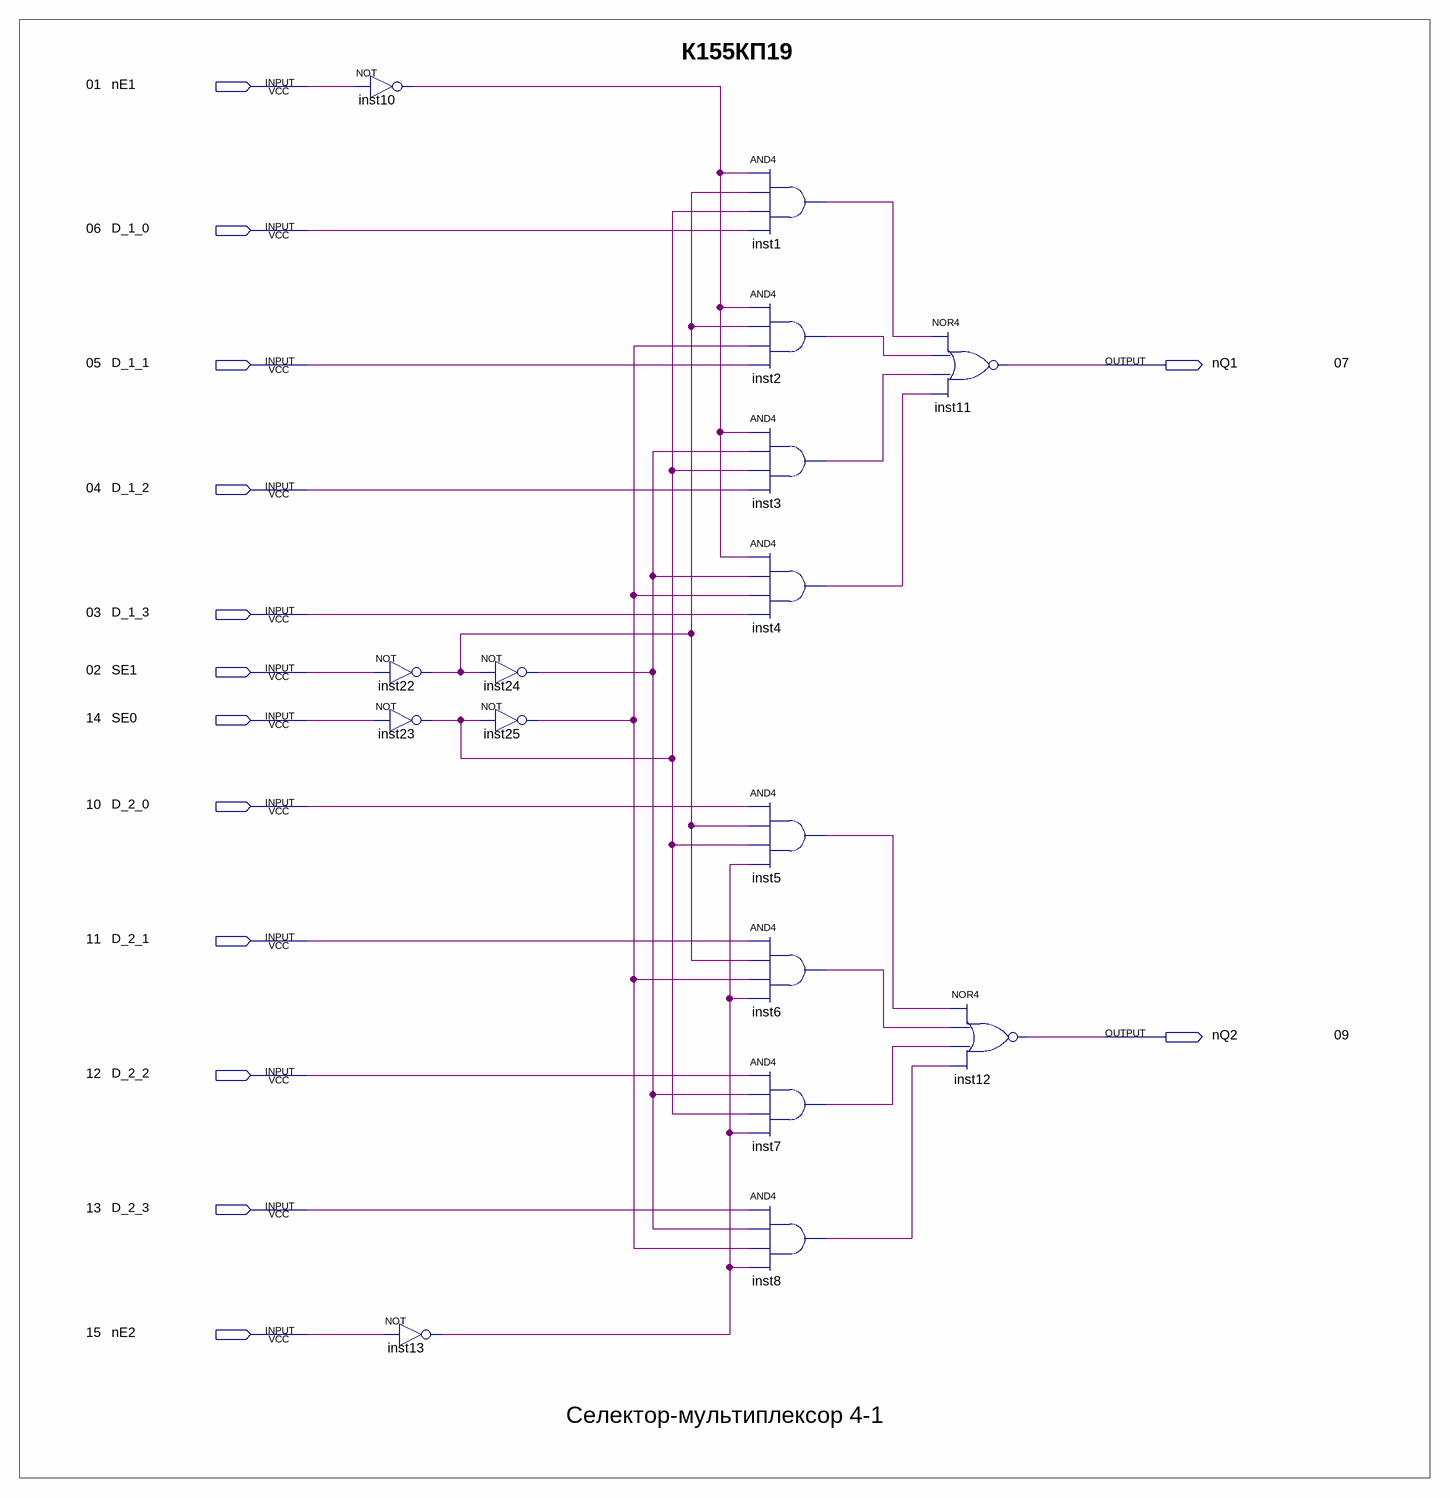
[diagram p0: schematic sheet]
// Quartus schematic K155KP19.bdf as structural Verilog: 16 symbols, 14 pins
module K155KP19 (
  input  nE1,
  input  D_1_0,
  input  D_1_1,
  input  D_1_2,
  input  D_1_3,
  input  SE1,
  input  SE0,
  input  D_2_0,
  input  D_2_1,
  input  D_2_2,
  input  D_2_3,
  input  nE2,
  output nQ1,
  output nQ2
);

  wire inst1_out, inst2_out, inst3_out, inst4_out, inst5_out, inst6_out, inst7_out, inst8_out, inst10_out,
       inst13_out, inst22_out, inst23_out, inst24_out, inst25_out;

  not inst10 (inst10_out, nE1);
  not inst22 (inst22_out, SE1);
  not inst23 (inst23_out, SE0);
  not inst13 (inst13_out, nE2);
  not inst24 (inst24_out, inst22_out);
  not inst25 (inst25_out, inst23_out);
  and inst1 (inst1_out, inst10_out, inst22_out, inst23_out, D_1_0);
  and inst2 (inst2_out, inst10_out, inst22_out, inst25_out, D_1_1);
  and inst3 (inst3_out, inst10_out, inst24_out, inst23_out, D_1_2);
  and inst4 (inst4_out, inst10_out, inst24_out, inst25_out, D_1_3);
  and inst5 (inst5_out, D_2_0, inst22_out, inst23_out, inst13_out);
  and inst6 (inst6_out, D_2_1, inst22_out, inst25_out, inst13_out);
  and inst7 (inst7_out, D_2_2, inst24_out, inst23_out, inst13_out);
  and inst8 (inst8_out, D_2_3, inst24_out, inst25_out, inst13_out);
  nor inst11 (nQ1, inst1_out, inst2_out, inst3_out, inst4_out);
  nor inst12 (nQ2, inst5_out, inst6_out, inst7_out, inst8_out);

  // Notes on the sheet:
  //   К155КП19
  //   01
  //   06
  //   05
  //   07
  //   04
  //   03
  //   02
  //   14
  //   10
  //   11
  //   09
  //   12
  //   13
  //   15
  //   Селектор-мультиплексор 4-1
endmodule
